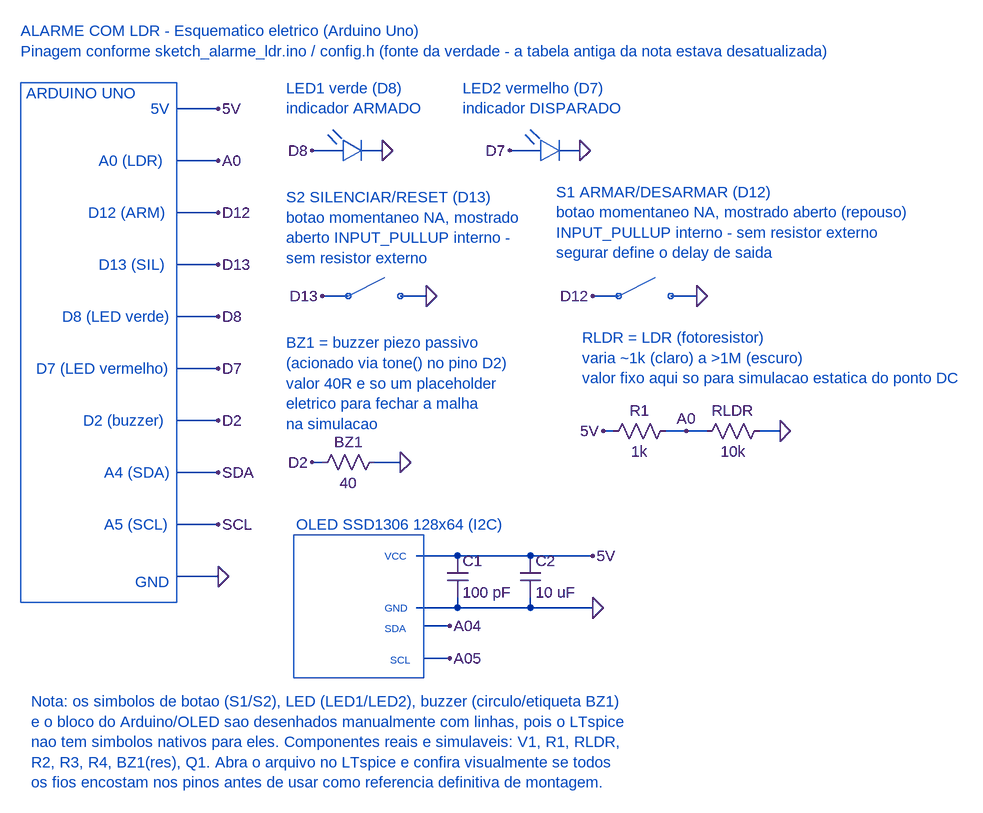
[diagram p0: schematic alarme_ldr.asc]
alarme_ldr.asc, the LTspice schematic file:
Version 4.1
SHEET 1 2344 1168
WIRE 336 80 272 80
WIRE 528 144 480 144
WIRE 588 144 556 144
WIRE 832 144 784 144
WIRE 892 144 860 144
WIRE 336 160 272 160
WIRE 336 240 272 240
WIRE 336 320 272 320
WIRE 536 368 496 368
WIRE 656 368 616 368
WIRE 952 368 912 368
WIRE 1072 368 1032 368
WIRE 336 400 272 400
WIRE 336 480 272 480
WIRE 336 560 272 560
WIRE 944 576 928 576
WIRE 1056 576 1024 576
WIRE 1088 576 1056 576
WIRE 1200 576 1168 576
WIRE 496 624 480 624
WIRE 616 624 576 624
WIRE 336 640 272 640
WIRE 336 720 272 720
WIRE 704 768 640 768
WIRE 816 768 704 768
WIRE 912 768 816 768
WIRE 336 800 272 800
WIRE 704 848 704 832
WIRE 704 848 640 848
WIRE 816 848 816 832
WIRE 816 848 704 848
WIRE 912 848 816 848
WIRE 692 876 652 876
WIRE 692 926 652 926
FLAG 336 80 5V
FLAG 336 160 A0
FLAG 336 240 D12
FLAG 336 320 D13
FLAG 336 400 D8
FLAG 336 480 D7
FLAG 336 560 D2
FLAG 336 640 SDA
FLAG 336 720 SCL
FLAG 336 800 0
FLAG 928 576 5V
FLAG 1056 576 A0
FLAG 1200 576 0
FLAG 912 368 D12
FLAG 1072 368 0
FLAG 496 368 D13
FLAG 656 368 0
FLAG 480 144 D8
FLAG 588 144 0
FLAG 784 144 D7
FLAG 892 144 0
FLAG 480 624 D2
FLAG 616 624 0
FLAG 692 876 A04
FLAG 692 926 A05
FLAG 912 848 0
FLAG 912 768 5V
SYMBOL res 928 592 R270
WINDOW 0 32 56 VTop 2
WINDOW 3 0 56 VBottom 2
SYMATTR InstName R1
SYMATTR Value 1k
SYMBOL res 1072 592 R270
WINDOW 0 32 56 VTop 2
WINDOW 3 0 56 VBottom 2
SYMATTR InstName RLDR
SYMATTR Value 10k
SYMBOL res 480 640 R270
WINDOW 0 32 56 VTop 2
WINDOW 3 0 56 VBottom 2
SYMATTR InstName BZ1
SYMATTR Value 40
SYMBOL cap 688 768 R0
SYMATTR InstName C1
SYMATTR Value 100 pF
SYMBOL cap 800 768 R0
SYMATTR InstName C2
SYMATTR Value 10 uF
TEXT 32 -40 Left 2 ;ALARME COM LDR - Esquematico eletrico (Arduino Uno)\nPinagem conforme sketch_alarme_ldr.ino / config.h (fonte da verdade - a tabela antiga da nota estava desatualizada)
TEXT 40 56 Left 2 ;ARDUINO UNO
TEXT 232 80 Left 2 ;5V
TEXT 152 160 Left 2 ;A0 (LDR)
TEXT 136 240 Left 2 ;D12 (ARM)
TEXT 152 320 Left 2 ;D13 (SIL)
TEXT 96 400 Left 2 ;D8 (LED verde)
TEXT 56 480 Left 2 ;D7 (LED vermelho)
TEXT 128 560 Left 2 ;D2 (buzzer)
TEXT 160 640 Left 2 ;A4 (SDA)
TEXT 160 720 Left 2 ;A5 (SCL)
TEXT 208 808 Left 2 ;GND
TEXT 896 432 Left 2 ;RLDR = LDR (fotoresistor)\nvaria ~1k (claro) a >1M (escuro)\nvalor fixo aqui so para simulacao estatica do ponto DC
TEXT 856 208 Left 2 ;S1 ARMAR/DESARMAR (D12)\nbotao momentaneo NA, mostrado aberto (repouso)\nINPUT_PULLUP interno - sem resistor externo\nsegurar define o delay de saida
TEXT 440 216 Left 2 ;S2 SILENCIAR/RESET (D13)\nbotao momentaneo NA, mostrado\naberto INPUT_PULLUP interno -\nsem resistor externo
TEXT 440 48 Left 2 ;LED1 verde (D8)\nindicador ARMADO
TEXT 712 48 Left 2 ;LED2 vermelho (D7)\nindicador DISPARADO
TEXT 440 440 Left 2 ;BZ1 = buzzer piezo passivo\n(acionado via tone() no pino D2)\nvalor 40R e so um placeholder\neletrico para fechar a malha \nna simulacao
TEXT 456 720 Left 2 ;OLED SSD1306 128x64 (I2C)
TEXT 592 768 Left 1 ;VCC
TEXT 592 848 Left 1 ;GND
TEXT 592 880 Left 1 ;SDA
TEXT 600 928 Left 1 ;SCL
TEXT 48 992 Left 2 ;Nota: os simbolos de botao (S1/S2), LED (LED1/LED2), buzzer (circulo/etiqueta BZ1)\ne o bloco do Arduino/OLED sao desenhados manualmente com linhas, pois o LTspice\nnao tem simbolos nativos para eles. Componentes reais e simulaveis: V1, R1, RLDR,\nR2, R3, R4, BZ1(res), Q1. Abra o arquivo no LTspice e confira visualmente se todos\nos fios encostam nos pinos antes de usar como referencia definitiva de montagem.
LINE Normal 32 40 272 40
LINE Normal 32 840 272 840
LINE Normal 32 40 32 840
LINE Normal 272 40 272 840
LINE Normal 452 736 652 736
LINE Normal 452 956 652 956
LINE Normal 452 736 452 956
LINE Normal 652 736 652 956
LINE Normal 952 368 1008 340
LINE Normal 536 368 592 340
LINE Normal 528 160 528 128
LINE Normal 528 160 556 144
LINE Normal 528 128 556 144
LINE Normal 556 160 556 128
LINE Normal 518 134 504 120
LINE Normal 526 126 512 112
LINE Normal 832 160 832 128
LINE Normal 832 160 860 144
LINE Normal 832 128 860 144
LINE Normal 860 160 860 128
LINE Normal 822 134 808 120
LINE Normal 830 126 816 112
CIRCLE Normal 948 372 956 364
CIRCLE Normal 1028 372 1036 364
CIRCLE Normal 532 372 540 364
CIRCLE Normal 612 372 620 364

The netlist it stands for:
* alarme_ldr.asc
R1 5V A0 1k
RLDR A0 0 10k
R§BZ1 D2 0 40
C1 5V 0 100 pF
C2 5V 0 10 uF
* ALARME COM LDR - Esquematico eletrico (Arduino Uno)
* Pinagem conforme sketch_alarme_ldr.ino / config.h (fonte da verdade - a tabela antiga da nota estava desatualizada)
* ARDUINO UNO
* 5V
* A0 (LDR)
* D12 (ARM)
* D13 (SIL)
* D8 (LED verde)
* D7 (LED vermelho)
* D2 (buzzer)
* A4 (SDA)
* A5 (SCL)
* GND
* RLDR = LDR (fotoresistor)
* varia ~1k (claro) a >1M (escuro)
* valor fixo aqui so para simulacao estatica do ponto DC
* S1 ARMAR/DESARMAR (D12)
* botao momentaneo NA, mostrado aberto (repouso)
* INPUT_PULLUP interno - sem resistor externo
* segurar define o delay de saida
* S2 SILENCIAR/RESET (D13)
* botao momentaneo NA, mostrado
* aberto INPUT_PULLUP interno -
* sem resistor externo
* LED1 verde (D8)
* indicador ARMADO
* LED2 vermelho (D7)
* indicador DISPARADO
* BZ1 = buzzer piezo passivo
* (acionado via tone() no pino D2)
* valor 40R e so um placeholder
* eletrico para fechar a malha
* na simulacao
* OLED SSD1306 128x64 (I2C)
* VCC
* GND
* SDA
* SCL
* Nota: os simbolos de botao (S1/S2), LED (LED1/LED2), buzzer (circulo/etiqueta BZ1)
* e o bloco do Arduino/OLED sao desenhados manualmente com linhas, pois o LTspice
* nao tem simbolos nativos para eles. Componentes reais e simulaveis: V1, R1, RLDR,
* R2, R3, R4, BZ1(res), Q1. Abra o arquivo no LTspice e confira visualmente se todos
* os fios encostam nos pinos antes de usar como referencia definitiva de montagem.
.backanno
.end